# EAGLE schematic schematics (EAGLE 9.6.2)
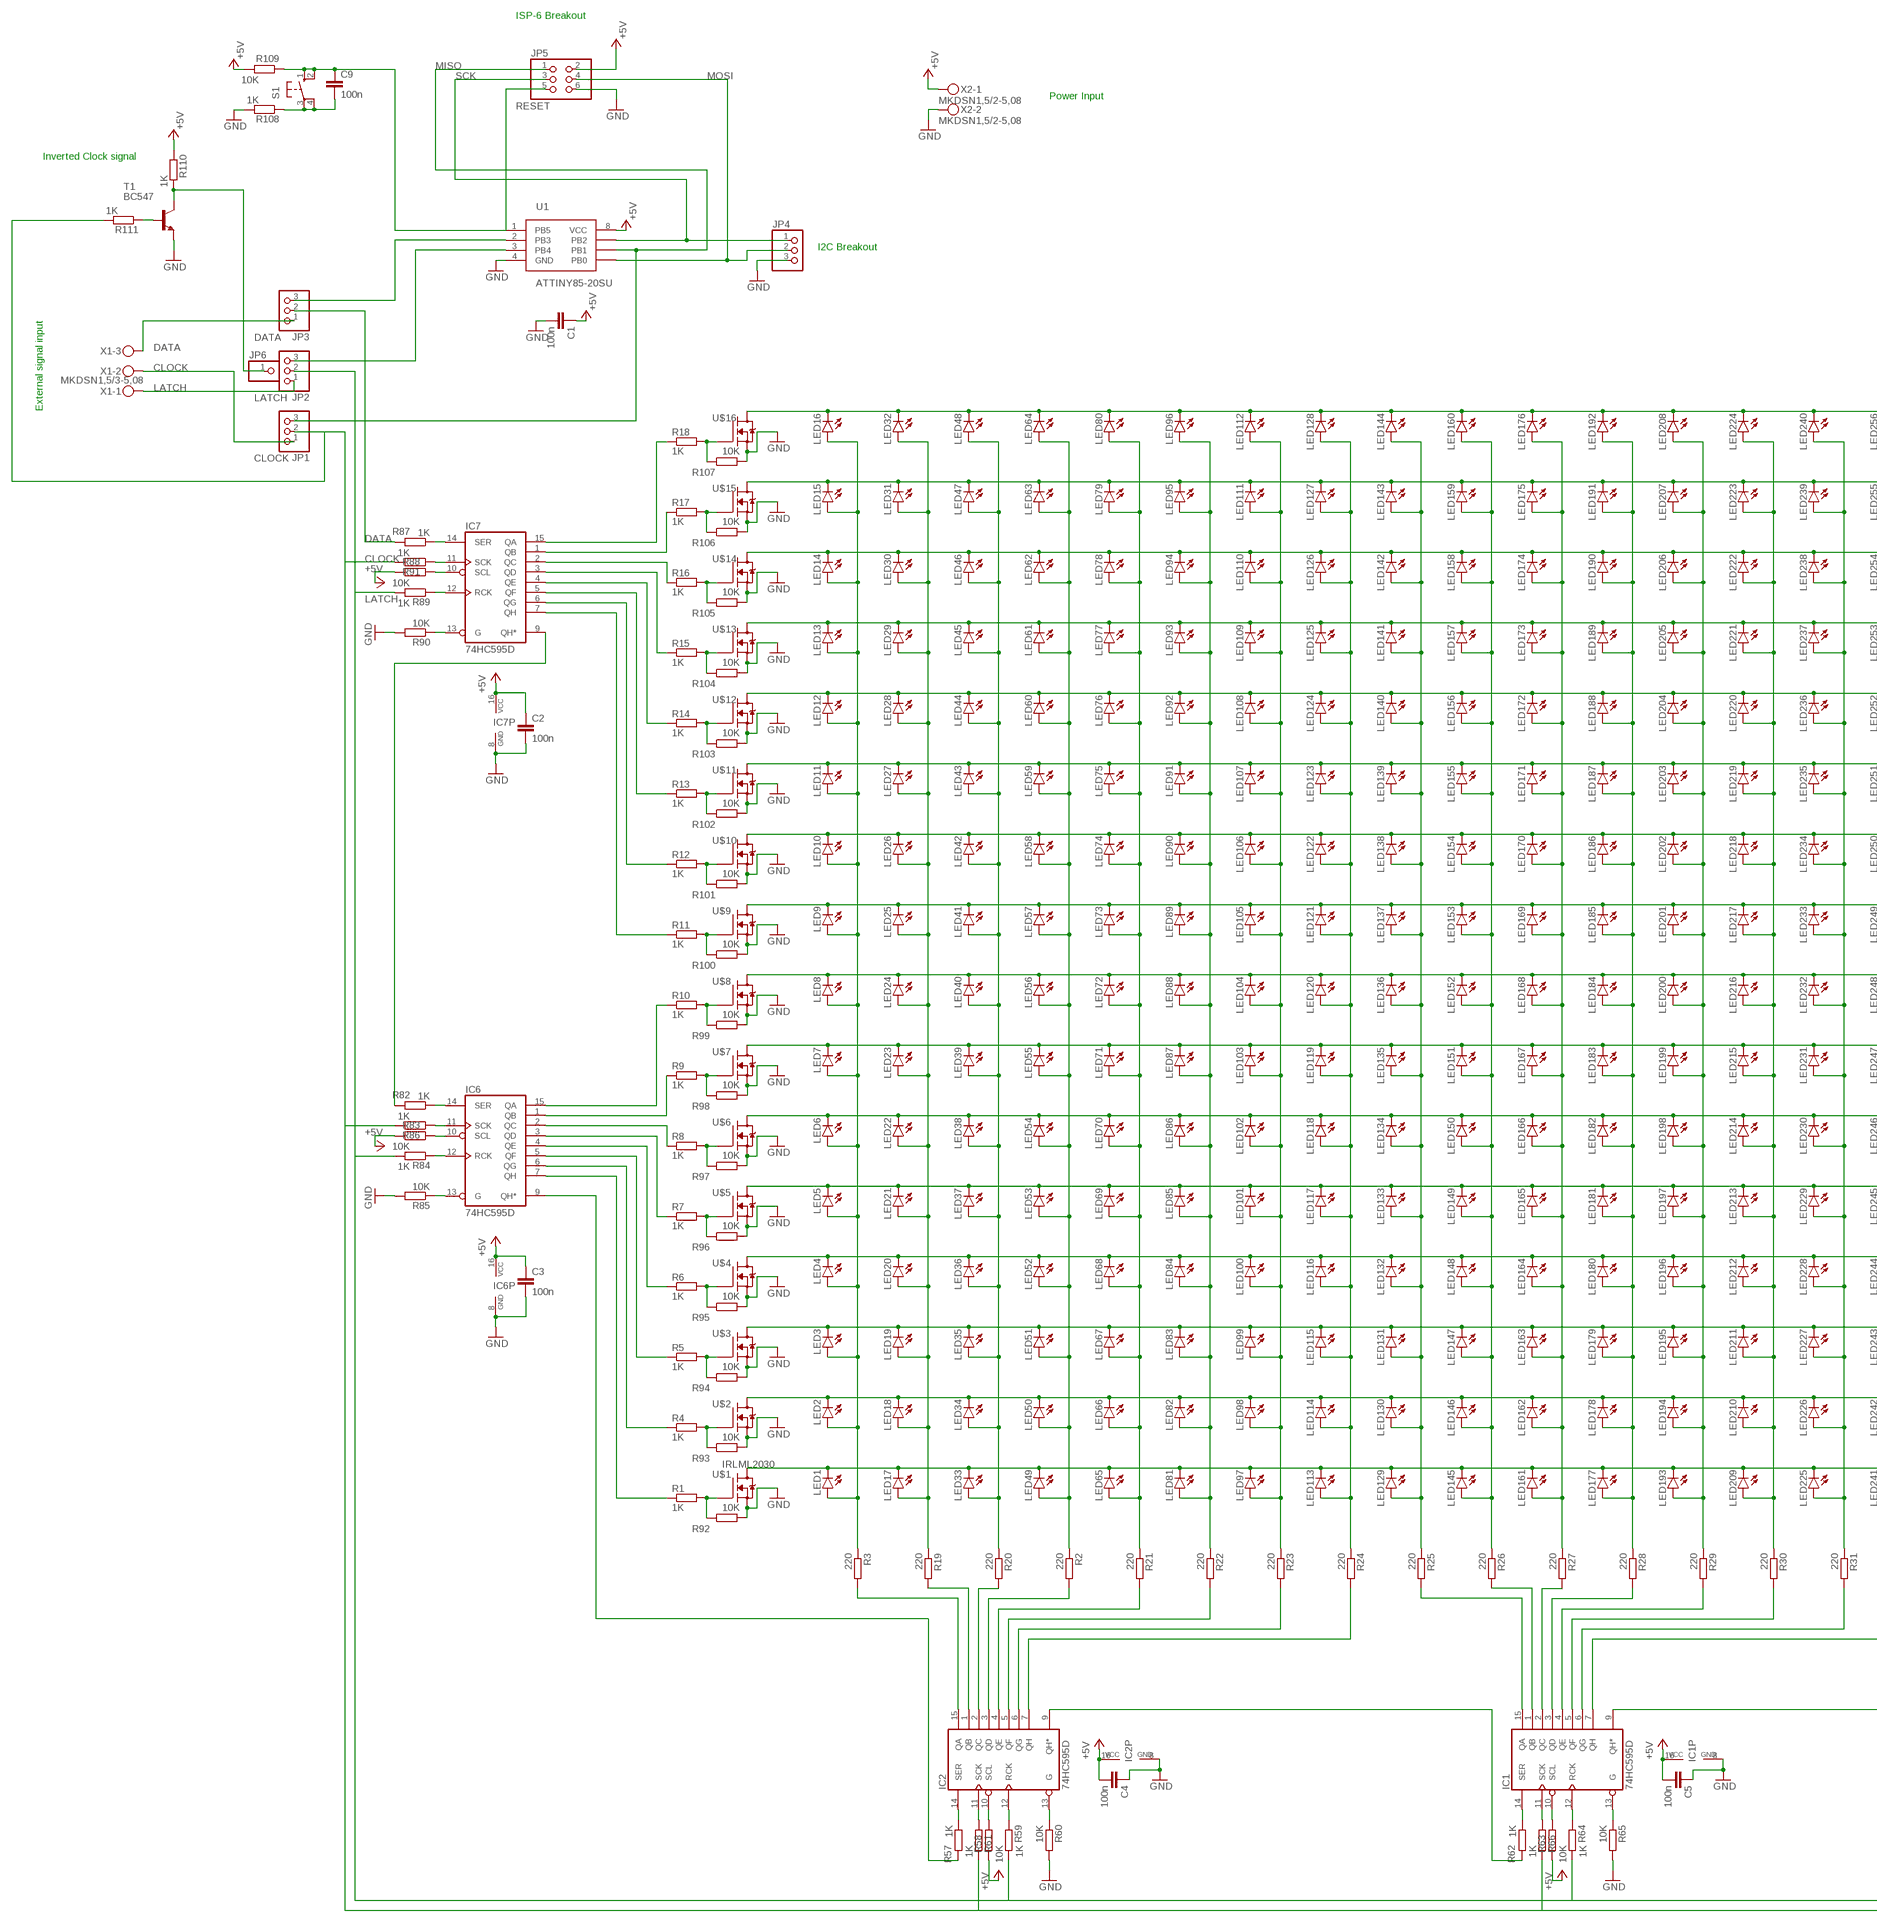
[diagram p0: schematic, sheet 1, part 1 of 2]
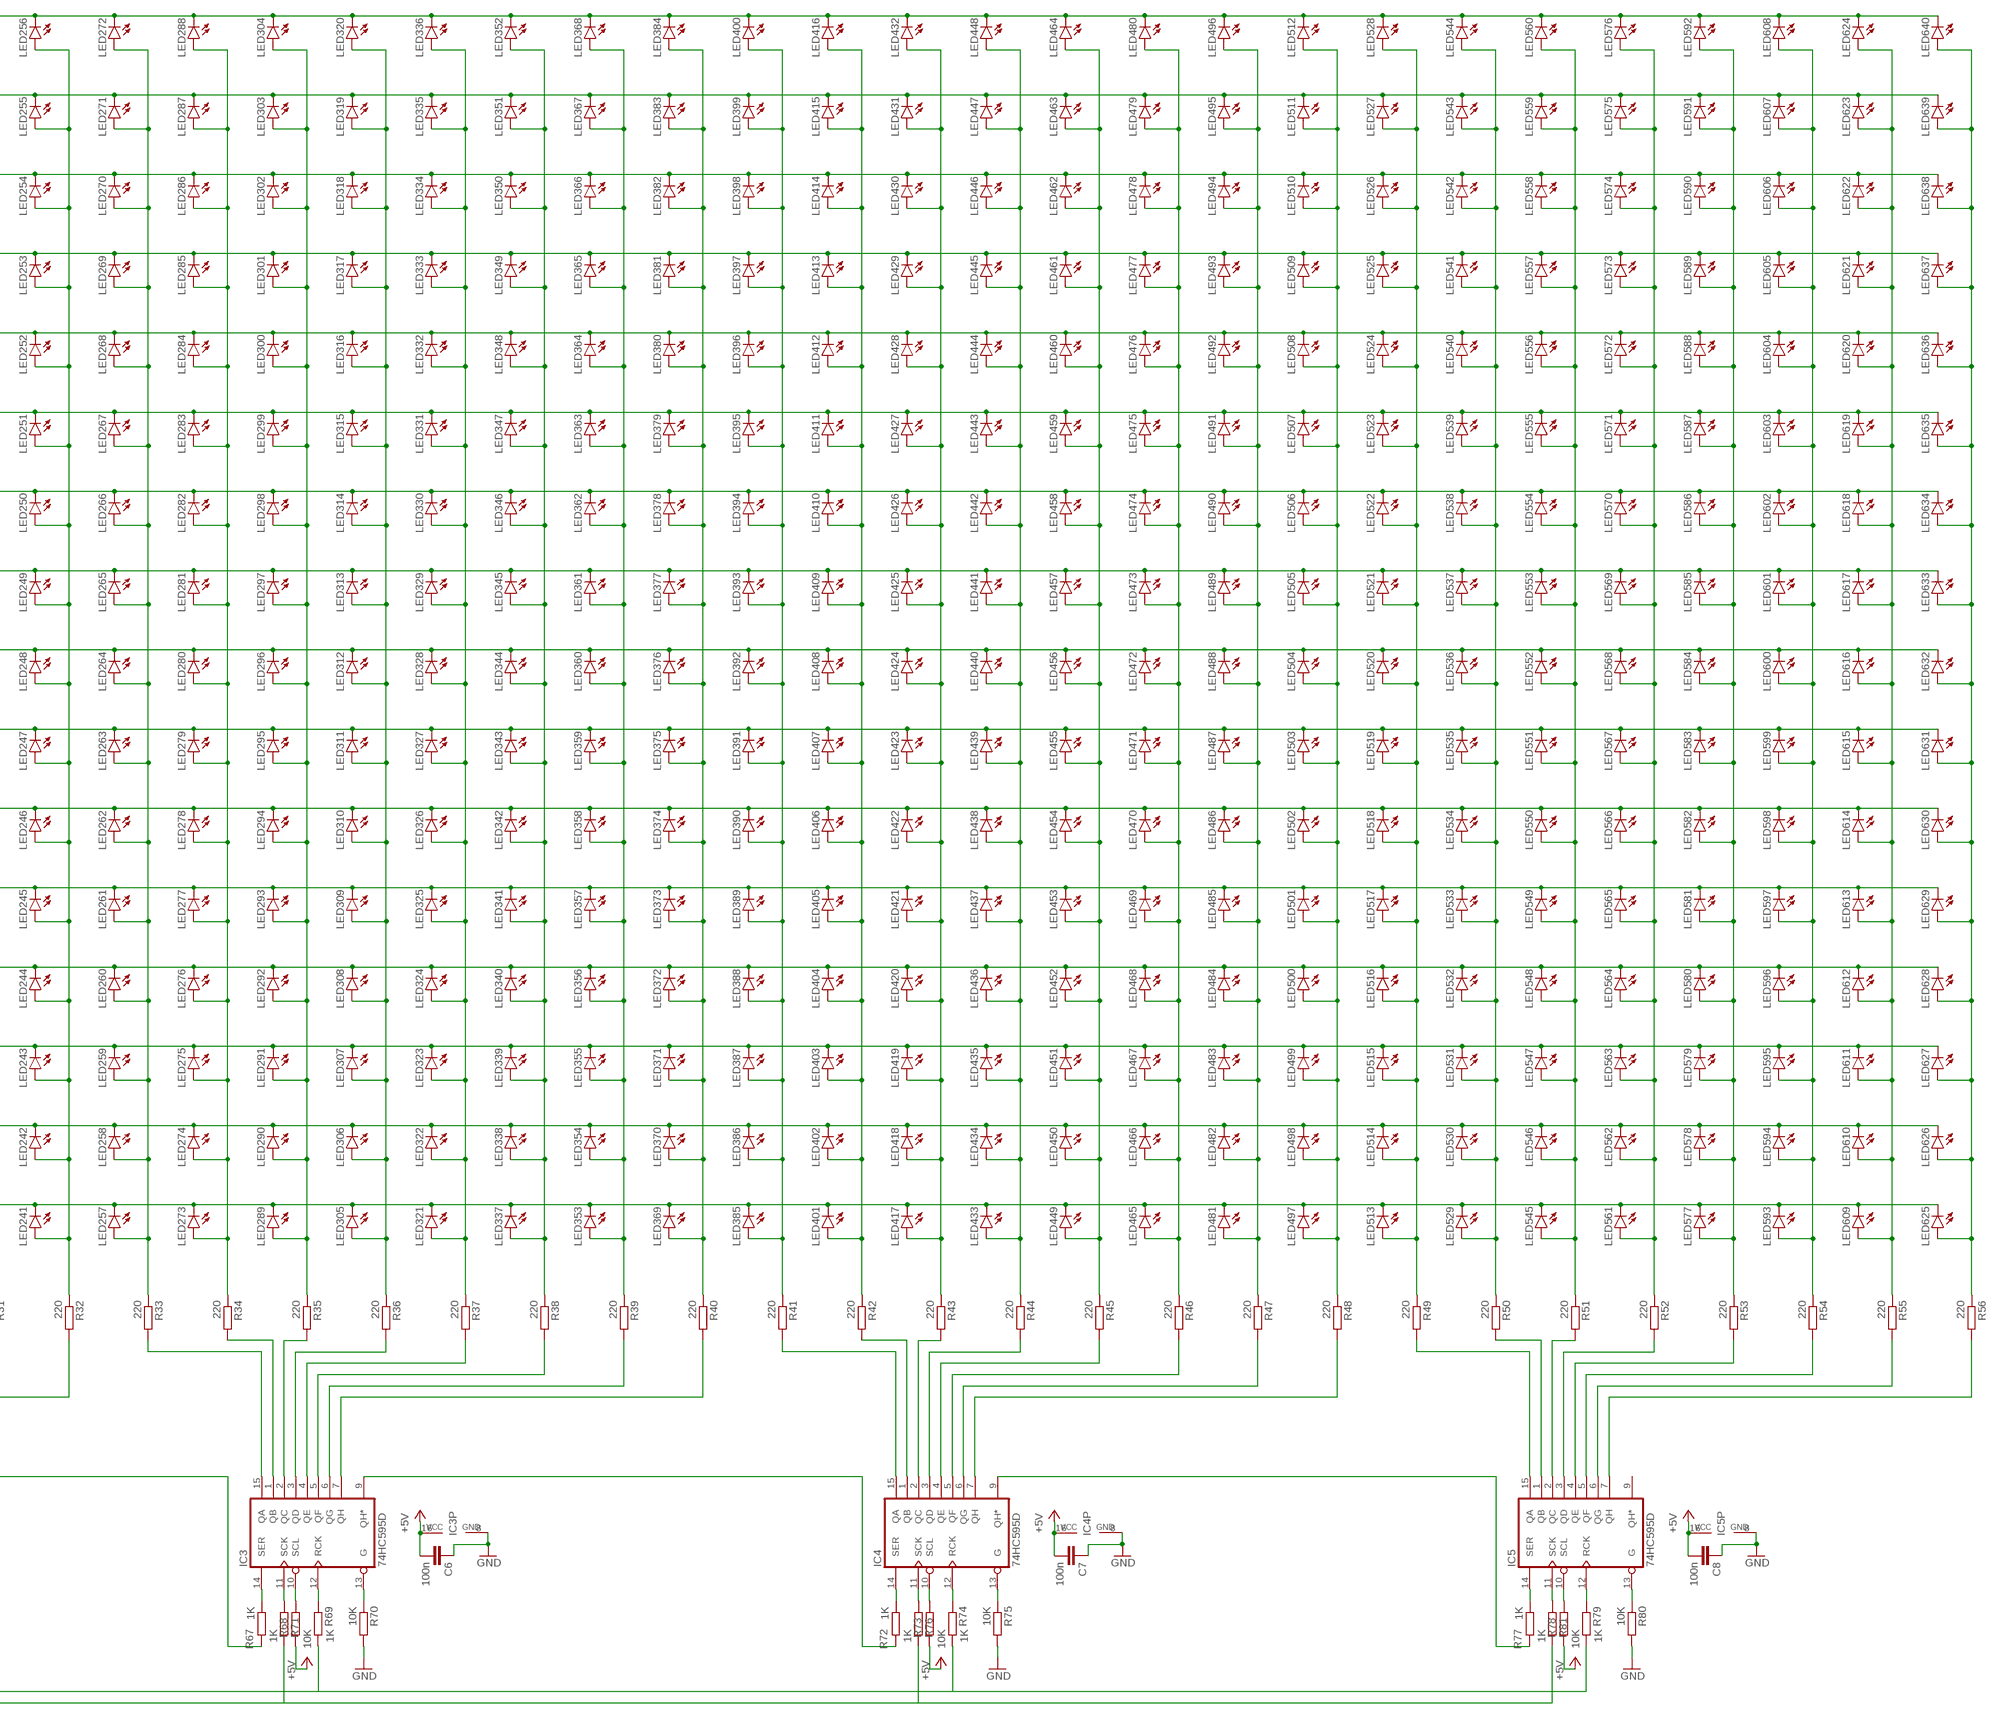
[diagram p1: schematic, sheet 1, part 2 of 2]

## Parts
C1  100n  C-EUC0805K  [C0805K]
C2  100n  C-EUC0805K  [C0805K]
C3  100n  C-EUC0805K  [C0805K]
C4  100n  C-EUC0805K  [C0805K]
C5  100n  C-EUC0805K  [C0805K]
C6  100n  C-EUC0805K  [C0805K]
C7  100n  C-EUC0805K  [C0805K]
C8  100n  C-EUC0805K  [C0805K]
C9  100n  C-EUC0805K  [C0805K]
IC1  74HC595D  [SO16]
IC2  74HC595D  [SO16]
IC3  74HC595D  [SO16]
IC4  74HC595D  [SO16]
IC5  74HC595D  [SO16]
IC6  74HC595D  [SO16]
IC7  74HC595D  [SO16]
JP1  PINHD-1X3  [1X03]
JP2  PINHD-1X3  [1X03]
JP3  PINHD-1X3  [1X03]
JP4  PINHD-1X3  [1X03]
JP5  PINHD-2X3  [2X03]
JP6  PINHD-1X1  [1X01]
LED1  LED3MM  [LED3MM]
LED2  LED3MM  [LED3MM]
LED3  LED3MM  [LED3MM]
LED4  LED3MM  [LED3MM]
LED5  LED3MM  [LED3MM]
LED6  LED3MM  [LED3MM]
LED7  LED3MM  [LED3MM]
LED8  LED3MM  [LED3MM]
LED9  LED3MM  [LED3MM]
LED10  LED3MM  [LED3MM]
LED11  LED3MM  [LED3MM]
LED12  LED3MM  [LED3MM]
LED13  LED3MM  [LED3MM]
LED14  LED3MM  [LED3MM]
LED15  LED3MM  [LED3MM]
LED16  LED3MM  [LED3MM]
LED17  LED3MM  [LED3MM]
LED18  LED3MM  [LED3MM]
LED19  LED3MM  [LED3MM]
LED20  LED3MM  [LED3MM]
LED21  LED3MM  [LED3MM]
LED22  LED3MM  [LED3MM]
LED23  LED3MM  [LED3MM]
LED24  LED3MM  [LED3MM]
LED25  LED3MM  [LED3MM]
LED26  LED3MM  [LED3MM]
LED27  LED3MM  [LED3MM]
LED28  LED3MM  [LED3MM]
LED29  LED3MM  [LED3MM]
LED30  LED3MM  [LED3MM]
LED31  LED3MM  [LED3MM]
LED32  LED3MM  [LED3MM]
LED33  LED3MM  [LED3MM]
LED34  LED3MM  [LED3MM]
LED35  LED3MM  [LED3MM]
LED36  LED3MM  [LED3MM]
LED37  LED3MM  [LED3MM]
LED38  LED3MM  [LED3MM]
LED39  LED3MM  [LED3MM]
LED40  LED3MM  [LED3MM]
LED41  LED3MM  [LED3MM]
LED42  LED3MM  [LED3MM]
LED43  LED3MM  [LED3MM]
LED44  LED3MM  [LED3MM]
LED45  LED3MM  [LED3MM]
LED46  LED3MM  [LED3MM]
LED47  LED3MM  [LED3MM]
LED48  LED3MM  [LED3MM]
LED49  LED3MM  [LED3MM]
LED50  LED3MM  [LED3MM]
LED51  LED3MM  [LED3MM]
LED52  LED3MM  [LED3MM]
LED53  LED3MM  [LED3MM]
LED54  LED3MM  [LED3MM]
LED55  LED3MM  [LED3MM]
LED56  LED3MM  [LED3MM]
LED57  LED3MM  [LED3MM]
LED58  LED3MM  [LED3MM]
LED59  LED3MM  [LED3MM]
LED60  LED3MM  [LED3MM]
LED61  LED3MM  [LED3MM]
LED62  LED3MM  [LED3MM]
LED63  LED3MM  [LED3MM]
LED64  LED3MM  [LED3MM]
LED65  LED3MM  [LED3MM]
LED66  LED3MM  [LED3MM]
LED67  LED3MM  [LED3MM]
LED68  LED3MM  [LED3MM]
LED69  LED3MM  [LED3MM]
LED70  LED3MM  [LED3MM]
LED71  LED3MM  [LED3MM]
LED72  LED3MM  [LED3MM]
LED73  LED3MM  [LED3MM]
LED74  LED3MM  [LED3MM]
LED75  LED3MM  [LED3MM]
LED76  LED3MM  [LED3MM]
LED77  LED3MM  [LED3MM]
LED78  LED3MM  [LED3MM]
LED79  LED3MM  [LED3MM]
LED80  LED3MM  [LED3MM]
LED81  LED3MM  [LED3MM]
LED82  LED3MM  [LED3MM]
LED83  LED3MM  [LED3MM]
LED84  LED3MM  [LED3MM]
LED85  LED3MM  [LED3MM]
LED86  LED3MM  [LED3MM]
LED87  LED3MM  [LED3MM]
LED88  LED3MM  [LED3MM]
LED89  LED3MM  [LED3MM]
LED90  LED3MM  [LED3MM]
LED91  LED3MM  [LED3MM]
LED92  LED3MM  [LED3MM]
LED93  LED3MM  [LED3MM]
LED94  LED3MM  [LED3MM]
LED95  LED3MM  [LED3MM]
LED96  LED3MM  [LED3MM]
LED97  LED3MM  [LED3MM]
LED98  LED3MM  [LED3MM]
LED99  LED3MM  [LED3MM]
LED100  LED3MM  [LED3MM]
LED101  LED3MM  [LED3MM]
LED102  LED3MM  [LED3MM]
LED103  LED3MM  [LED3MM]
LED104  LED3MM  [LED3MM]
LED105  LED3MM  [LED3MM]
LED106  LED3MM  [LED3MM]
LED107  LED3MM  [LED3MM]
LED108  LED3MM  [LED3MM]
LED109  LED3MM  [LED3MM]
LED110  LED3MM  [LED3MM]
LED111  LED3MM  [LED3MM]
LED112  LED3MM  [LED3MM]
LED113  LED3MM  [LED3MM]
LED114  LED3MM  [LED3MM]
LED115  LED3MM  [LED3MM]
LED116  LED3MM  [LED3MM]
LED117  LED3MM  [LED3MM]
LED118  LED3MM  [LED3MM]
LED119  LED3MM  [LED3MM]
LED120  LED3MM  [LED3MM]
LED121  LED3MM  [LED3MM]
LED122  LED3MM  [LED3MM]
LED123  LED3MM  [LED3MM]
LED124  LED3MM  [LED3MM]
LED125  LED3MM  [LED3MM]
LED126  LED3MM  [LED3MM]
LED127  LED3MM  [LED3MM]
LED128  LED3MM  [LED3MM]
LED129  LED3MM  [LED3MM]
LED130  LED3MM  [LED3MM]
LED131  LED3MM  [LED3MM]
LED132  LED3MM  [LED3MM]
LED133  LED3MM  [LED3MM]
LED134  LED3MM  [LED3MM]
LED135  LED3MM  [LED3MM]
LED136  LED3MM  [LED3MM]
LED137  LED3MM  [LED3MM]
LED138  LED3MM  [LED3MM]
LED139  LED3MM  [LED3MM]
LED140  LED3MM  [LED3MM]
LED141  LED3MM  [LED3MM]
LED142  LED3MM  [LED3MM]
LED143  LED3MM  [LED3MM]
LED144  LED3MM  [LED3MM]
LED145  LED3MM  [LED3MM]
LED146  LED3MM  [LED3MM]
LED147  LED3MM  [LED3MM]
LED148  LED3MM  [LED3MM]
LED149  LED3MM  [LED3MM]
LED150  LED3MM  [LED3MM]
LED151  LED3MM  [LED3MM]
LED152  LED3MM  [LED3MM]
LED153  LED3MM  [LED3MM]
LED154  LED3MM  [LED3MM]
LED155  LED3MM  [LED3MM]
LED156  LED3MM  [LED3MM]
LED157  LED3MM  [LED3MM]
LED158  LED3MM  [LED3MM]
LED159  LED3MM  [LED3MM]
LED160  LED3MM  [LED3MM]
LED161  LED3MM  [LED3MM]
LED162  LED3MM  [LED3MM]
LED163  LED3MM  [LED3MM]
LED164  LED3MM  [LED3MM]
LED165  LED3MM  [LED3MM]
LED166  LED3MM  [LED3MM]
LED167  LED3MM  [LED3MM]
LED168  LED3MM  [LED3MM]
LED169  LED3MM  [LED3MM]
LED170  LED3MM  [LED3MM]
LED171  LED3MM  [LED3MM]
LED172  LED3MM  [LED3MM]
LED173  LED3MM  [LED3MM]
LED174  LED3MM  [LED3MM]
LED175  LED3MM  [LED3MM]
LED176  LED3MM  [LED3MM]
LED177  LED3MM  [LED3MM]
LED178  LED3MM  [LED3MM]
LED179  LED3MM  [LED3MM]
LED180  LED3MM  [LED3MM]
LED181  LED3MM  [LED3MM]
LED182  LED3MM  [LED3MM]
LED183  LED3MM  [LED3MM]
LED184  LED3MM  [LED3MM]
LED185  LED3MM  [LED3MM]
LED186  LED3MM  [LED3MM]
LED187  LED3MM  [LED3MM]
LED188  LED3MM  [LED3MM]
LED189  LED3MM  [LED3MM]
LED190  LED3MM  [LED3MM]
LED191  LED3MM  [LED3MM]
LED192  LED3MM  [LED3MM]
LED193  LED3MM  [LED3MM]
LED194  LED3MM  [LED3MM]
LED195  LED3MM  [LED3MM]
LED196  LED3MM  [LED3MM]
LED197  LED3MM  [LED3MM]
LED198  LED3MM  [LED3MM]
LED199  LED3MM  [LED3MM]
LED200  LED3MM  [LED3MM]
LED201  LED3MM  [LED3MM]
LED202  LED3MM  [LED3MM]
LED203  LED3MM  [LED3MM]
LED204  LED3MM  [LED3MM]
LED205  LED3MM  [LED3MM]
LED206  LED3MM  [LED3MM]
LED207  LED3MM  [LED3MM]
LED208  LED3MM  [LED3MM]
LED209  LED3MM  [LED3MM]
LED210  LED3MM  [LED3MM]
LED211  LED3MM  [LED3MM]
LED212  LED3MM  [LED3MM]
LED213  LED3MM  [LED3MM]
LED214  LED3MM  [LED3MM]
LED215  LED3MM  [LED3MM]
LED216  LED3MM  [LED3MM]
LED217  LED3MM  [LED3MM]
LED218  LED3MM  [LED3MM]
LED219  LED3MM  [LED3MM]
LED220  LED3MM  [LED3MM]
LED221  LED3MM  [LED3MM]
LED222  LED3MM  [LED3MM]
LED223  LED3MM  [LED3MM]
LED224  LED3MM  [LED3MM]
LED225  LED3MM  [LED3MM]
LED226  LED3MM  [LED3MM]
LED227  LED3MM  [LED3MM]
LED228  LED3MM  [LED3MM]
LED229  LED3MM  [LED3MM]
LED230  LED3MM  [LED3MM]
LED231  LED3MM  [LED3MM]
LED232  LED3MM  [LED3MM]
LED233  LED3MM  [LED3MM]
LED234  LED3MM  [LED3MM]
LED235  LED3MM  [LED3MM]
LED236  LED3MM  [LED3MM]
LED237  LED3MM  [LED3MM]
LED238  LED3MM  [LED3MM]
LED239  LED3MM  [LED3MM]
LED240  LED3MM  [LED3MM]
LED241  LED3MM  [LED3MM]
LED242  LED3MM  [LED3MM]
LED243  LED3MM  [LED3MM]
LED244  LED3MM  [LED3MM]
LED245  LED3MM  [LED3MM]
LED246  LED3MM  [LED3MM]
LED247  LED3MM  [LED3MM]
LED248  LED3MM  [LED3MM]
LED249  LED3MM  [LED3MM]
LED250  LED3MM  [LED3MM]
LED251  LED3MM  [LED3MM]
LED252  LED3MM  [LED3MM]
LED253  LED3MM  [LED3MM]
LED254  LED3MM  [LED3MM]
LED255  LED3MM  [LED3MM]
LED256  LED3MM  [LED3MM]
LED257  LED3MM  [LED3MM]
LED258  LED3MM  [LED3MM]
LED259  LED3MM  [LED3MM]
LED260  LED3MM  [LED3MM]
LED261  LED3MM  [LED3MM]
LED262  LED3MM  [LED3MM]
LED263  LED3MM  [LED3MM]
LED264  LED3MM  [LED3MM]
LED265  LED3MM  [LED3MM]
LED266  LED3MM  [LED3MM]
LED267  LED3MM  [LED3MM]
LED268  LED3MM  [LED3MM]
LED269  LED3MM  [LED3MM]
LED270  LED3MM  [LED3MM]
LED271  LED3MM  [LED3MM]
LED272  LED3MM  [LED3MM]
LED273  LED3MM  [LED3MM]
LED274  LED3MM  [LED3MM]
LED275  LED3MM  [LED3MM]
LED276  LED3MM  [LED3MM]
LED277  LED3MM  [LED3MM]
LED278  LED3MM  [LED3MM]
LED279  LED3MM  [LED3MM]
LED280  LED3MM  [LED3MM]
LED281  LED3MM  [LED3MM]
LED282  LED3MM  [LED3MM]
LED283  LED3MM  [LED3MM]
LED284  LED3MM  [LED3MM]
LED285  LED3MM  [LED3MM]
LED286  LED3MM  [LED3MM]
LED287  LED3MM  [LED3MM]
LED288  LED3MM  [LED3MM]
LED289  LED3MM  [LED3MM]
LED290  LED3MM  [LED3MM]
LED291  LED3MM  [LED3MM]
LED292  LED3MM  [LED3MM]
LED293  LED3MM  [LED3MM]
LED294  LED3MM  [LED3MM]
LED295  LED3MM  [LED3MM]
LED296  LED3MM  [LED3MM]
LED297  LED3MM  [LED3MM]
LED298  LED3MM  [LED3MM]
LED299  LED3MM  [LED3MM]
LED300  LED3MM  [LED3MM]
LED301  LED3MM  [LED3MM]
LED302  LED3MM  [LED3MM]
LED303  LED3MM  [LED3MM]
LED304  LED3MM  [LED3MM]
LED305  LED3MM  [LED3MM]
LED306  LED3MM  [LED3MM]
LED307  LED3MM  [LED3MM]
LED308  LED3MM  [LED3MM]
LED309  LED3MM  [LED3MM]
LED310  LED3MM  [LED3MM]
LED311  LED3MM  [LED3MM]
LED312  LED3MM  [LED3MM]
LED313  LED3MM  [LED3MM]
LED314  LED3MM  [LED3MM]
LED315  LED3MM  [LED3MM]
LED316  LED3MM  [LED3MM]
LED317  LED3MM  [LED3MM]
LED318  LED3MM  [LED3MM]
LED319  LED3MM  [LED3MM]
LED320  LED3MM  [LED3MM]
LED321  LED3MM  [LED3MM]
LED322  LED3MM  [LED3MM]
LED323  LED3MM  [LED3MM]
LED324  LED3MM  [LED3MM]
LED325  LED3MM  [LED3MM]
LED326  LED3MM  [LED3MM]
LED327  LED3MM  [LED3MM]
LED328  LED3MM  [LED3MM]
LED329  LED3MM  [LED3MM]
LED330  LED3MM  [LED3MM]
LED331  LED3MM  [LED3MM]
LED332  LED3MM  [LED3MM]
LED333  LED3MM  [LED3MM]
LED334  LED3MM  [LED3MM]
LED335  LED3MM  [LED3MM]
LED336  LED3MM  [LED3MM]
LED337  LED3MM  [LED3MM]
LED338  LED3MM  [LED3MM]
LED339  LED3MM  [LED3MM]
LED340  LED3MM  [LED3MM]
LED341  LED3MM  [LED3MM]
LED342  LED3MM  [LED3MM]
LED343  LED3MM  [LED3MM]
LED344  LED3MM  [LED3MM]
LED345  LED3MM  [LED3MM]
LED346  LED3MM  [LED3MM]
LED347  LED3MM  [LED3MM]
LED348  LED3MM  [LED3MM]
LED349  LED3MM  [LED3MM]
LED350  LED3MM  [LED3MM]
LED351  LED3MM  [LED3MM]
LED352  LED3MM  [LED3MM]
LED353  LED3MM  [LED3MM]
LED354  LED3MM  [LED3MM]
LED355  LED3MM  [LED3MM]
LED356  LED3MM  [LED3MM]
LED357  LED3MM  [LED3MM]
LED358  LED3MM  [LED3MM]
LED359  LED3MM  [LED3MM]
LED360  LED3MM  [LED3MM]
LED361  LED3MM  [LED3MM]
LED362  LED3MM  [LED3MM]
LED363  LED3MM  [LED3MM]
LED364  LED3MM  [LED3MM]
LED365  LED3MM  [LED3MM]
LED366  LED3MM  [LED3MM]
LED367  LED3MM  [LED3MM]
LED368  LED3MM  [LED3MM]
LED369  LED3MM  [LED3MM]
LED370  LED3MM  [LED3MM]
LED371  LED3MM  [LED3MM]
LED372  LED3MM  [LED3MM]
LED373  LED3MM  [LED3MM]
LED374  LED3MM  [LED3MM]
LED375  LED3MM  [LED3MM]
LED376  LED3MM  [LED3MM]
LED377  LED3MM  [LED3MM]
LED378  LED3MM  [LED3MM]
LED379  LED3MM  [LED3MM]
LED380  LED3MM  [LED3MM]
LED381  LED3MM  [LED3MM]
LED382  LED3MM  [LED3MM]
LED383  LED3MM  [LED3MM]
LED384  LED3MM  [LED3MM]
LED385  LED3MM  [LED3MM]
LED386  LED3MM  [LED3MM]
LED387  LED3MM  [LED3MM]
LED388  LED3MM  [LED3MM]
LED389  LED3MM  [LED3MM]
LED390  LED3MM  [LED3MM]
LED391  LED3MM  [LED3MM]
LED392  LED3MM  [LED3MM]
LED393  LED3MM  [LED3MM]
LED394  LED3MM  [LED3MM]
LED395  LED3MM  [LED3MM]
LED396  LED3MM  [LED3MM]
LED397  LED3MM  [LED3MM]
LED398  LED3MM  [LED3MM]
LED399  LED3MM  [LED3MM]
LED400  LED3MM  [LED3MM]
LED401  LED3MM  [LED3MM]
LED402  LED3MM  [LED3MM]
LED403  LED3MM  [LED3MM]
LED404  LED3MM  [LED3MM]
LED405  LED3MM  [LED3MM]
LED406  LED3MM  [LED3MM]
LED407  LED3MM  [LED3MM]
LED408  LED3MM  [LED3MM]
LED409  LED3MM  [LED3MM]
LED410  LED3MM  [LED3MM]
LED411  LED3MM  [LED3MM]
LED412  LED3MM  [LED3MM]
LED413  LED3MM  [LED3MM]
LED414  LED3MM  [LED3MM]
LED415  LED3MM  [LED3MM]
LED416  LED3MM  [LED3MM]
LED417  LED3MM  [LED3MM]
LED418  LED3MM  [LED3MM]
LED419  LED3MM  [LED3MM]
LED420  LED3MM  [LED3MM]
LED421  LED3MM  [LED3MM]
LED422  LED3MM  [LED3MM]
LED423  LED3MM  [LED3MM]
LED424  LED3MM  [LED3MM]
LED425  LED3MM  [LED3MM]
LED426  LED3MM  [LED3MM]
LED427  LED3MM  [LED3MM]
LED428  LED3MM  [LED3MM]
LED429  LED3MM  [LED3MM]
LED430  LED3MM  [LED3MM]
LED431  LED3MM  [LED3MM]
LED432  LED3MM  [LED3MM]
LED433  LED3MM  [LED3MM]
LED434  LED3MM  [LED3MM]
LED435  LED3MM  [LED3MM]
LED436  LED3MM  [LED3MM]
LED437  LED3MM  [LED3MM]
LED438  LED3MM  [LED3MM]
LED439  LED3MM  [LED3MM]
LED440  LED3MM  [LED3MM]
LED441  LED3MM  [LED3MM]
LED442  LED3MM  [LED3MM]
LED443  LED3MM  [LED3MM]
LED444  LED3MM  [LED3MM]
LED445  LED3MM  [LED3MM]
LED446  LED3MM  [LED3MM]
LED447  LED3MM  [LED3MM]
LED448  LED3MM  [LED3MM]
LED449  LED3MM  [LED3MM]
LED450  LED3MM  [LED3MM]
LED451  LED3MM  [LED3MM]
LED452  LED3MM  [LED3MM]
LED453  LED3MM  [LED3MM]
LED454  LED3MM  [LED3MM]
LED455  LED3MM  [LED3MM]
LED456  LED3MM  [LED3MM]
LED457  LED3MM  [LED3MM]
LED458  LED3MM  [LED3MM]
LED459  LED3MM  [LED3MM]
LED460  LED3MM  [LED3MM]
LED461  LED3MM  [LED3MM]
LED462  LED3MM  [LED3MM]
LED463  LED3MM  [LED3MM]
LED464  LED3MM  [LED3MM]
LED465  LED3MM  [LED3MM]
LED466  LED3MM  [LED3MM]
LED467  LED3MM  [LED3MM]
LED468  LED3MM  [LED3MM]
LED469  LED3MM  [LED3MM]
LED470  LED3MM  [LED3MM]
LED471  LED3MM  [LED3MM]
LED472  LED3MM  [LED3MM]
LED473  LED3MM  [LED3MM]
LED474  LED3MM  [LED3MM]
LED475  LED3MM  [LED3MM]
LED476  LED3MM  [LED3MM]
LED477  LED3MM  [LED3MM]
LED478  LED3MM  [LED3MM]
LED479  LED3MM  [LED3MM]
LED480  LED3MM  [LED3MM]
LED481  LED3MM  [LED3MM]
LED482  LED3MM  [LED3MM]
LED483  LED3MM  [LED3MM]
LED484  LED3MM  [LED3MM]
LED485  LED3MM  [LED3MM]
LED486  LED3MM  [LED3MM]
LED487  LED3MM  [LED3MM]
LED488  LED3MM  [LED3MM]
LED489  LED3MM  [LED3MM]
LED490  LED3MM  [LED3MM]
LED491  LED3MM  [LED3MM]
LED492  LED3MM  [LED3MM]
LED493  LED3MM  [LED3MM]
LED494  LED3MM  [LED3MM]
LED495  LED3MM  [LED3MM]
LED496  LED3MM  [LED3MM]
LED497  LED3MM  [LED3MM]
LED498  LED3MM  [LED3MM]
LED499  LED3MM  [LED3MM]
LED500  LED3MM  [LED3MM]
LED501  LED3MM  [LED3MM]
LED502  LED3MM  [LED3MM]
LED503  LED3MM  [LED3MM]
LED504  LED3MM  [LED3MM]
LED505  LED3MM  [LED3MM]
LED506  LED3MM  [LED3MM]
LED507  LED3MM  [LED3MM]
LED508  LED3MM  [LED3MM]
LED509  LED3MM  [LED3MM]
LED510  LED3MM  [LED3MM]
LED511  LED3MM  [LED3MM]
LED512  LED3MM  [LED3MM]
LED513  LED3MM  [LED3MM]
LED514  LED3MM  [LED3MM]
LED515  LED3MM  [LED3MM]
LED516  LED3MM  [LED3MM]
LED517  LED3MM  [LED3MM]
LED518  LED3MM  [LED3MM]
LED519  LED3MM  [LED3MM]
LED520  LED3MM  [LED3MM]
LED521  LED3MM  [LED3MM]
LED522  LED3MM  [LED3MM]
LED523  LED3MM  [LED3MM]
LED524  LED3MM  [LED3MM]
LED525  LED3MM  [LED3MM]
LED526  LED3MM  [LED3MM]
LED527  LED3MM  [LED3MM]
LED528  LED3MM  [LED3MM]
LED529  LED3MM  [LED3MM]
LED530  LED3MM  [LED3MM]
LED531  LED3MM  [LED3MM]
LED532  LED3MM  [LED3MM]
LED533  LED3MM  [LED3MM]
LED534  LED3MM  [LED3MM]
LED535  LED3MM  [LED3MM]
LED536  LED3MM  [LED3MM]
LED537  LED3MM  [LED3MM]
LED538  LED3MM  [LED3MM]
LED539  LED3MM  [LED3MM]
LED540  LED3MM  [LED3MM]
LED541  LED3MM  [LED3MM]
LED542  LED3MM  [LED3MM]
LED543  LED3MM  [LED3MM]
LED544  LED3MM  [LED3MM]
LED545  LED3MM  [LED3MM]
LED546  LED3MM  [LED3MM]
LED547  LED3MM  [LED3MM]
LED548  LED3MM  [LED3MM]
LED549  LED3MM  [LED3MM]
LED550  LED3MM  [LED3MM]
LED551  LED3MM  [LED3MM]
LED552  LED3MM  [LED3MM]
LED553  LED3MM  [LED3MM]
LED554  LED3MM  [LED3MM]
LED555  LED3MM  [LED3MM]
LED556  LED3MM  [LED3MM]
LED557  LED3MM  [LED3MM]
LED558  LED3MM  [LED3MM]
LED559  LED3MM  [LED3MM]
LED560  LED3MM  [LED3MM]
LED561  LED3MM  [LED3MM]
LED562  LED3MM  [LED3MM]
LED563  LED3MM  [LED3MM]
LED564  LED3MM  [LED3MM]
LED565  LED3MM  [LED3MM]
LED566  LED3MM  [LED3MM]
LED567  LED3MM  [LED3MM]
LED568  LED3MM  [LED3MM]
LED569  LED3MM  [LED3MM]
LED570  LED3MM  [LED3MM]
LED571  LED3MM  [LED3MM]
LED572  LED3MM  [LED3MM]
LED573  LED3MM  [LED3MM]
LED574  LED3MM  [LED3MM]
LED575  LED3MM  [LED3MM]
LED576  LED3MM  [LED3MM]
LED577  LED3MM  [LED3MM]
LED578  LED3MM  [LED3MM]
LED579  LED3MM  [LED3MM]
LED580  LED3MM  [LED3MM]
LED581  LED3MM  [LED3MM]
LED582  LED3MM  [LED3MM]
LED583  LED3MM  [LED3MM]
LED584  LED3MM  [LED3MM]
LED585  LED3MM  [LED3MM]
LED586  LED3MM  [LED3MM]
LED587  LED3MM  [LED3MM]
LED588  LED3MM  [LED3MM]
LED589  LED3MM  [LED3MM]
LED590  LED3MM  [LED3MM]
LED591  LED3MM  [LED3MM]
LED592  LED3MM  [LED3MM]
LED593  LED3MM  [LED3MM]
LED594  LED3MM  [LED3MM]
LED595  LED3MM  [LED3MM]
LED596  LED3MM  [LED3MM]
LED597  LED3MM  [LED3MM]
LED598  LED3MM  [LED3MM]
LED599  LED3MM  [LED3MM]
LED600  LED3MM  [LED3MM]
LED601  LED3MM  [LED3MM]
LED602  LED3MM  [LED3MM]
LED603  LED3MM  [LED3MM]
LED604  LED3MM  [LED3MM]
LED605  LED3MM  [LED3MM]
LED606  LED3MM  [LED3MM]
LED607  LED3MM  [LED3MM]
LED608  LED3MM  [LED3MM]
LED609  LED3MM  [LED3MM]
LED610  LED3MM  [LED3MM]
LED611  LED3MM  [LED3MM]
LED612  LED3MM  [LED3MM]
LED613  LED3MM  [LED3MM]
LED614  LED3MM  [LED3MM]
LED615  LED3MM  [LED3MM]
LED616  LED3MM  [LED3MM]
LED617  LED3MM  [LED3MM]
LED618  LED3MM  [LED3MM]
LED619  LED3MM  [LED3MM]
LED620  LED3MM  [LED3MM]
LED621  LED3MM  [LED3MM]
LED622  LED3MM  [LED3MM]
LED623  LED3MM  [LED3MM]
LED624  LED3MM  [LED3MM]
LED625  LED3MM  [LED3MM]
LED626  LED3MM  [LED3MM]
LED627  LED3MM  [LED3MM]
LED628  LED3MM  [LED3MM]
LED629  LED3MM  [LED3MM]
LED630  LED3MM  [LED3MM]
LED631  LED3MM  [LED3MM]
LED632  LED3MM  [LED3MM]
LED633  LED3MM  [LED3MM]
LED634  LED3MM  [LED3MM]
LED635  LED3MM  [LED3MM]
LED636  LED3MM  [LED3MM]
LED637  LED3MM  [LED3MM]
LED638  LED3MM  [LED3MM]
LED639  LED3MM  [LED3MM]
LED640  LED3MM  [LED3MM]
R1  1K  R-EU_R0805W  [R0805W]
R2  220  R-EU_R0805W  [R0805W]
R3  220  R-EU_R0805W  [R0805W]
R4  1K  R-EU_R0805W  [R0805W]
R5  1K  R-EU_R0805W  [R0805W]
R6  1K  R-EU_R0805W  [R0805W]
R7  1K  R-EU_R0805W  [R0805W]
R8  1K  R-EU_R0805W  [R0805W]
R9  1K  R-EU_R0805W  [R0805W]
R10  1K  R-EU_R0805W  [R0805W]
R11  1K  R-EU_R0805W  [R0805W]
R12  1K  R-EU_R0805W  [R0805W]
R13  1K  R-EU_R0805W  [R0805W]
R14  1K  R-EU_R0805W  [R0805W]
R15  1K  R-EU_R0805W  [R0805W]
R16  1K  R-EU_R0805W  [R0805W]
R17  1K  R-EU_R0805W  [R0805W]
R18  1K  R-EU_R0805W  [R0805W]
R19  220  R-EU_R0805W  [R0805W]
R20  220  R-EU_R0805W  [R0805W]
R21  220  R-EU_R0805W  [R0805W]
R22  220  R-EU_R0805W  [R0805W]
R23  220  R-EU_R0805W  [R0805W]
R24  220  R-EU_R0805W  [R0805W]
R25  220  R-EU_R0805W  [R0805W]
R26  220  R-EU_R0805W  [R0805W]
R27  220  R-EU_R0805W  [R0805W]
R28  220  R-EU_R0805W  [R0805W]
R29  220  R-EU_R0805W  [R0805W]
R30  220  R-EU_R0805W  [R0805W]
R31  220  R-EU_R0805W  [R0805W]
R32  220  R-EU_R0805W  [R0805W]
R33  220  R-EU_R0805W  [R0805W]
R34  220  R-EU_R0805W  [R0805W]
R35  220  R-EU_R0805W  [R0805W]
R36  220  R-EU_R0805W  [R0805W]
R37  220  R-EU_R0805W  [R0805W]
R38  220  R-EU_R0805W  [R0805W]
R39  220  R-EU_R0805W  [R0805W]
R40  220  R-EU_R0805W  [R0805W]
R41  220  R-EU_R0805W  [R0805W]
R42  220  R-EU_R0805W  [R0805W]
R43  220  R-EU_R0805W  [R0805W]
R44  220  R-EU_R0805W  [R0805W]
R45  220  R-EU_R0805W  [R0805W]
R46  220  R-EU_R0805W  [R0805W]
R47  220  R-EU_R0805W  [R0805W]
R48  220  R-EU_R0805W  [R0805W]
R49  220  R-EU_R0805W  [R0805W]
R50  220  R-EU_R0805W  [R0805W]
R51  220  R-EU_R0805W  [R0805W]
R52  220  R-EU_R0805W  [R0805W]
R53  220  R-EU_R0805W  [R0805W]
R54  220  R-EU_R0805W  [R0805W]
R55  220  R-EU_R0805W  [R0805W]
R56  220  R-EU_R0805W  [R0805W]
R57  1K  R-EU_R0805W  [R0805W]
R58  1K  R-EU_R0805W  [R0805W]
R59  1K  R-EU_R0805W  [R0805W]
R60  10K  R-EU_R0805W  [R0805W]
R61  10K  R-EU_R0805W  [R0805W]
R62  1K  R-EU_R0805W  [R0805W]
R63  1K  R-EU_R0805W  [R0805W]
R64  1K  R-EU_R0805W  [R0805W]
R65  10K  R-EU_R0805W  [R0805W]
R66  10K  R-EU_R0805W  [R0805W]
R67  1K  R-EU_R0805W  [R0805W]
R68  1K  R-EU_R0805W  [R0805W]
R69  1K  R-EU_R0805W  [R0805W]
R70  10K  R-EU_R0805W  [R0805W]
R71  10K  R-EU_R0805W  [R0805W]
R72  1K  R-EU_R0805W  [R0805W]
R73  1K  R-EU_R0805W  [R0805W]
R74  1K  R-EU_R0805W  [R0805W]
R75  10K  R-EU_R0805W  [R0805W]
R76  10K  R-EU_R0805W  [R0805W]
R77  1K  R-EU_R0805W  [R0805W]
R78  1K  R-EU_R0805W  [R0805W]
R79  1K  R-EU_R0805W  [R0805W]
R80  10K  R-EU_R0805W  [R0805W]
R81  10K  R-EU_R0805W  [R0805W]
R82  1K  R-EU_R0805W  [R0805W]
R83  1K  R-EU_R0805W  [R0805W]
R84  1K  R-EU_R0805W  [R0805W]
R85  10K  R-EU_R0805W  [R0805W]
R86  10K  R-EU_R0805W  [R0805W]
R87  1K  R-EU_R0805W  [R0805W]
R88  1K  R-EU_R0805W  [R0805W]
R89  1K  R-EU_R0805W  [R0805W]
R90  10K  R-EU_R0805W  [R0805W]
R91  10K  R-EU_R0805W  [R0805W]
R92  10K  R-EU_R0805W  [R0805W]
R93  10K  R-EU_R0805W  [R0805W]
R94  10K  R-EU_R0805W  [R0805W]
R95  10K  R-EU_R0805W  [R0805W]
R96  10K  R-EU_R0805W  [R0805W]
R97  10K  R-EU_R0805W  [R0805W]
R98  10K  R-EU_R0805W  [R0805W]
R99  10K  R-EU_R0805W  [R0805W]
R100  10K  R-EU_R0805W  [R0805W]
R101  10K  R-EU_R0805W  [R0805W]
R102  10K  R-EU_R0805W  [R0805W]
R103  10K  R-EU_R0805W  [R0805W]
R104  10K  R-EU_R0805W  [R0805W]
R105  10K  R-EU_R0805W  [R0805W]
R106  10K  R-EU_R0805W  [R0805W]
R107  10K  R-EU_R0805W  [R0805W]
R108  1K  R-EU_R0805W  [R0805W]
R109  10K  R-EU_R0805W  [R0805W]
R110  1K  R-EU_R0805W  [R0805W]
R111  1K  R-EU_R0805W  [R0805W]
S1  10-XX  [B3F-10XX]
T1  BC547  [TO92]
U1  ATTINY85-20SU  [SOIC-8]
U$1  IRLML2030  [SOT23]
U$2  IRLML2030  [SOT23]
U$3  IRLML2030  [SOT23]
U$4  IRLML2030  [SOT23]
U$5  IRLML2030  [SOT23]
U$6  IRLML2030  [SOT23]
U$7  IRLML2030  [SOT23]
U$8  IRLML2030  [SOT23]
U$9  IRLML2030  [SOT23]
U$10  IRLML2030  [SOT23]
U$11  IRLML2030  [SOT23]
U$12  IRLML2030  [SOT23]
U$13  IRLML2030  [SOT23]
U$14  IRLML2030  [SOT23]
U$15  IRLML2030  [SOT23]
U$16  IRLML2030  [SOT23]
X1  MKDSN1,5/3-5,08  [MKDSN1,5/3-5,08]
X2  MKDSN1,5/2-5,08  [MKDSN1,5/2-5,08]

## Nets
+5V: C1.1 C2.1 C3.1 C4.2 C5.2 C6.2 C7.2 C8.2 IC1.16(VCC) IC2.16(VCC) IC3.16(VCC) IC4.16(VCC) IC5.16(VCC) IC6.16(VCC) IC7.16(VCC) JP5.2 R61.2 R66.2 R71.2 R76.2 R81.2 R86.2 R91.2 R109.2 R110.1 U1.8(VCC) X2.1
CLOCK: JP1.2 R58.2 R63.2 R68.2 R73.2 R78.2 R83.2 R88.2 R111.2
DATA: JP3.2 R87.2
GND: C1.2 C2.2 C3.2 C4.1 C5.1 C6.1 C7.1 C8.1 IC1.8(GND) IC2.8(GND) IC3.8(GND) IC4.8(GND) IC5.8(GND) IC6.8(GND) IC7.8(GND) JP4.3 JP5.6 R60.2 R65.2 R70.2 R75.2 R80.2 R85.2 R90.2 R92.2 R93.2 R94.2 R95.2 R96.2 R97.2 R98.2 R99.2 R100.2 R101.2 R102.2 R103.2 R104.2 R105.2 R106.2 R107.2 R108.2 T1.1(E) U1.4(GND) U$1.2(S) U$2.2(S) U$3.2(S) U$4.2(S) U$5.2(S) U$6.2(S) U$7.2(S) U$8.2(S) U$9.2(S) U$10.2(S) U$11.2(S) U$12.2(S) U$13.2(S) U$14.2(S) U$15.2(S) U$16.2(S) X2.2
LATCH: JP2.2 R59.2 R64.2 R69.2 R74.2 R79.2 R84.2 R89.2
MISO: JP1.3 JP5.1 U1.6(PB1)
MOSI: JP4.2 JP5.4 U1.5(PB0)
N$1: LED1.A LED2.A LED3.A LED4.A LED5.A LED6.A LED7.A LED8.A LED9.A LED10.A LED11.A LED12.A LED13.A LED14.A LED15.A LED16.A R3.1
N$2: LED2.K(C) LED18.K(C) LED34.K(C) LED50.K(C) LED66.K(C) LED82.K(C) LED98.K(C) LED114.K(C) LED130.K(C) LED146.K(C) LED162.K(C) LED178.K(C) LED194.K(C) LED210.K(C) LED226.K(C) LED242.K(C) LED258.K(C) LED274.K(C) LED290.K(C) LED306.K(C) LED322.K(C) LED338.K(C) LED354.K(C) LED370.K(C) LED386.K(C) LED402.K(C) LED418.K(C) LED434.K(C) LED450.K(C) LED466.K(C) LED482.K(C) LED498.K(C) LED514.K(C) LED530.K(C) LED546.K(C) LED562.K(C) LED578.K(C) LED594.K(C) LED610.K(C) LED626.K(C) U$2.3(D)
N$3: R4.2 R93.1 U$2.1(G)
N$4: LED3.K(C) LED19.K(C) LED35.K(C) LED51.K(C) LED67.K(C) LED83.K(C) LED99.K(C) LED115.K(C) LED131.K(C) LED147.K(C) LED163.K(C) LED179.K(C) LED195.K(C) LED211.K(C) LED227.K(C) LED243.K(C) LED259.K(C) LED275.K(C) LED291.K(C) LED307.K(C) LED323.K(C) LED339.K(C) LED355.K(C) LED371.K(C) LED387.K(C) LED403.K(C) LED419.K(C) LED435.K(C) LED451.K(C) LED467.K(C) LED483.K(C) LED499.K(C) LED515.K(C) LED531.K(C) LED547.K(C) LED563.K(C) LED579.K(C) LED595.K(C) LED611.K(C) LED627.K(C) U$3.3(D)
N$5: R5.2 R94.1 U$3.1(G)
N$6: LED4.K(C) LED20.K(C) LED36.K(C) LED52.K(C) LED68.K(C) LED84.K(C) LED100.K(C) LED116.K(C) LED132.K(C) LED148.K(C) LED164.K(C) LED180.K(C) LED196.K(C) LED212.K(C) LED228.K(C) LED244.K(C) LED260.K(C) LED276.K(C) LED292.K(C) LED308.K(C) LED324.K(C) LED340.K(C) LED356.K(C) LED372.K(C) LED388.K(C) LED404.K(C) LED420.K(C) LED436.K(C) LED452.K(C) LED468.K(C) LED484.K(C) LED500.K(C) LED516.K(C) LED532.K(C) LED548.K(C) LED564.K(C) LED580.K(C) LED596.K(C) LED612.K(C) LED628.K(C) U$4.3(D)
N$7: R6.2 R95.1 U$4.1(G)
N$8: LED5.K(C) LED21.K(C) LED37.K(C) LED53.K(C) LED69.K(C) LED85.K(C) LED101.K(C) LED117.K(C) LED133.K(C) LED149.K(C) LED165.K(C) LED181.K(C) LED197.K(C) LED213.K(C) LED229.K(C) LED245.K(C) LED261.K(C) LED277.K(C) LED293.K(C) LED309.K(C) LED325.K(C) LED341.K(C) LED357.K(C) LED373.K(C) LED389.K(C) LED405.K(C) LED421.K(C) LED437.K(C) LED453.K(C) LED469.K(C) LED485.K(C) LED501.K(C) LED517.K(C) LED533.K(C) LED549.K(C) LED565.K(C) LED581.K(C) LED597.K(C) LED613.K(C) LED629.K(C) U$5.3(D)
N$9: R7.2 R96.1 U$5.1(G)
N$10: LED6.K(C) LED22.K(C) LED38.K(C) LED54.K(C) LED70.K(C) LED86.K(C) LED102.K(C) LED118.K(C) LED134.K(C) LED150.K(C) LED166.K(C) LED182.K(C) LED198.K(C) LED214.K(C) LED230.K(C) LED246.K(C) LED262.K(C) LED278.K(C) LED294.K(C) LED310.K(C) LED326.K(C) LED342.K(C) LED358.K(C) LED374.K(C) LED390.K(C) LED406.K(C) LED422.K(C) LED438.K(C) LED454.K(C) LED470.K(C) LED486.K(C) LED502.K(C) LED518.K(C) LED534.K(C) LED550.K(C) LED566.K(C) LED582.K(C) LED598.K(C) LED614.K(C) LED630.K(C) U$6.3(D)
N$11: R8.2 R97.1 U$6.1(G)
N$12: LED7.K(C) LED23.K(C) LED39.K(C) LED55.K(C) LED71.K(C) LED87.K(C) LED103.K(C) LED119.K(C) LED135.K(C) LED151.K(C) LED167.K(C) LED183.K(C) LED199.K(C) LED215.K(C) LED231.K(C) LED247.K(C) LED263.K(C) LED279.K(C) LED295.K(C) LED311.K(C) LED327.K(C) LED343.K(C) LED359.K(C) LED375.K(C) LED391.K(C) LED407.K(C) LED423.K(C) LED439.K(C) LED455.K(C) LED471.K(C) LED487.K(C) LED503.K(C) LED519.K(C) LED535.K(C) LED551.K(C) LED567.K(C) LED583.K(C) LED599.K(C) LED615.K(C) LED631.K(C) U$7.3(D)
N$13: R9.2 R98.1 U$7.1(G)
N$14: LED8.K(C) LED24.K(C) LED40.K(C) LED56.K(C) LED72.K(C) LED88.K(C) LED104.K(C) LED120.K(C) LED136.K(C) LED152.K(C) LED168.K(C) LED184.K(C) LED200.K(C) LED216.K(C) LED232.K(C) LED248.K(C) LED264.K(C) LED280.K(C) LED296.K(C) LED312.K(C) LED328.K(C) LED344.K(C) LED360.K(C) LED376.K(C) LED392.K(C) LED408.K(C) LED424.K(C) LED440.K(C) LED456.K(C) LED472.K(C) LED488.K(C) LED504.K(C) LED520.K(C) LED536.K(C) LED552.K(C) LED568.K(C) LED584.K(C) LED600.K(C) LED616.K(C) LED632.K(C) U$8.3(D)
N$15: R10.2 R99.1 U$8.1(G)
N$16: LED1.K(C) LED17.K(C) LED33.K(C) LED49.K(C) LED65.K(C) LED81.K(C) LED97.K(C) LED113.K(C) LED129.K(C) LED145.K(C) LED161.K(C) LED177.K(C) LED193.K(C) LED209.K(C) LED225.K(C) LED241.K(C) LED257.K(C) LED273.K(C) LED289.K(C) LED305.K(C) LED321.K(C) LED337.K(C) LED353.K(C) LED369.K(C) LED385.K(C) LED401.K(C) LED417.K(C) LED433.K(C) LED449.K(C) LED465.K(C) LED481.K(C) LED497.K(C) LED513.K(C) LED529.K(C) LED545.K(C) LED561.K(C) LED577.K(C) LED593.K(C) LED609.K(C) LED625.K(C) U$1.3(D)
N$17: R1.2 R92.1 U$1.1(G)
N$18: LED9.K(C) LED25.K(C) LED41.K(C) LED57.K(C) LED73.K(C) LED89.K(C) LED105.K(C) LED121.K(C) LED137.K(C) LED153.K(C) LED169.K(C) LED185.K(C) LED201.K(C) LED217.K(C) LED233.K(C) LED249.K(C) LED265.K(C) LED281.K(C) LED297.K(C) LED313.K(C) LED329.K(C) LED345.K(C) LED361.K(C) LED377.K(C) LED393.K(C) LED409.K(C) LED425.K(C) LED441.K(C) LED457.K(C) LED473.K(C) LED489.K(C) LED505.K(C) LED521.K(C) LED537.K(C) LED553.K(C) LED569.K(C) LED585.K(C) LED601.K(C) LED617.K(C) LED633.K(C) U$9.3(D)
N$19: R11.2 R100.1 U$9.1(G)
N$20: LED10.K(C) LED26.K(C) LED42.K(C) LED58.K(C) LED74.K(C) LED90.K(C) LED106.K(C) LED122.K(C) LED138.K(C) LED154.K(C) LED170.K(C) LED186.K(C) LED202.K(C) LED218.K(C) LED234.K(C) LED250.K(C) LED266.K(C) LED282.K(C) LED298.K(C) LED314.K(C) LED330.K(C) LED346.K(C) LED362.K(C) LED378.K(C) LED394.K(C) LED410.K(C) LED426.K(C) LED442.K(C) LED458.K(C) LED474.K(C) LED490.K(C) LED506.K(C) LED522.K(C) LED538.K(C) LED554.K(C) LED570.K(C) LED586.K(C) LED602.K(C) LED618.K(C) LED634.K(C) U$10.3(D)
N$21: R12.2 R101.1 U$10.1(G)
N$22: LED11.K(C) LED27.K(C) LED43.K(C) LED59.K(C) LED75.K(C) LED91.K(C) LED107.K(C) LED123.K(C) LED139.K(C) LED155.K(C) LED171.K(C) LED187.K(C) LED203.K(C) LED219.K(C) LED235.K(C) LED251.K(C) LED267.K(C) LED283.K(C) LED299.K(C) LED315.K(C) LED331.K(C) LED347.K(C) LED363.K(C) LED379.K(C) LED395.K(C) LED411.K(C) LED427.K(C) LED443.K(C) LED459.K(C) LED475.K(C) LED491.K(C) LED507.K(C) LED523.K(C) LED539.K(C) LED555.K(C) LED571.K(C) LED587.K(C) LED603.K(C) LED619.K(C) LED635.K(C) U$11.3(D)
N$23: R13.2 R102.1 U$11.1(G)
N$24: LED12.K(C) LED28.K(C) LED44.K(C) LED60.K(C) LED76.K(C) LED92.K(C) LED108.K(C) LED124.K(C) LED140.K(C) LED156.K(C) LED172.K(C) LED188.K(C) LED204.K(C) LED220.K(C) LED236.K(C) LED252.K(C) LED268.K(C) LED284.K(C) LED300.K(C) LED316.K(C) LED332.K(C) LED348.K(C) LED364.K(C) LED380.K(C) LED396.K(C) LED412.K(C) LED428.K(C) LED444.K(C) LED460.K(C) LED476.K(C) LED492.K(C) LED508.K(C) LED524.K(C) LED540.K(C) LED556.K(C) LED572.K(C) LED588.K(C) LED604.K(C) LED620.K(C) LED636.K(C) U$12.3(D)
N$25: R14.2 R103.1 U$12.1(G)
N$26: LED13.K(C) LED29.K(C) LED45.K(C) LED61.K(C) LED77.K(C) LED93.K(C) LED109.K(C) LED125.K(C) LED141.K(C) LED157.K(C) LED173.K(C) LED189.K(C) LED205.K(C) LED221.K(C) LED237.K(C) LED253.K(C) LED269.K(C) LED285.K(C) LED301.K(C) LED317.K(C) LED333.K(C) LED349.K(C) LED365.K(C) LED381.K(C) LED397.K(C) LED413.K(C) LED429.K(C) LED445.K(C) LED461.K(C) LED477.K(C) LED493.K(C) LED509.K(C) LED525.K(C) LED541.K(C) LED557.K(C) LED573.K(C) LED589.K(C) LED605.K(C) LED621.K(C) LED637.K(C) U$13.3(D)
N$27: R15.2 R104.1 U$13.1(G)
N$28: LED14.K(C) LED30.K(C) LED46.K(C) LED62.K(C) LED78.K(C) LED94.K(C) LED110.K(C) LED126.K(C) LED142.K(C) LED158.K(C) LED174.K(C) LED190.K(C) LED206.K(C) LED222.K(C) LED238.K(C) LED254.K(C) LED270.K(C) LED286.K(C) LED302.K(C) LED318.K(C) LED334.K(C) LED350.K(C) LED366.K(C) LED382.K(C) LED398.K(C) LED414.K(C) LED430.K(C) LED446.K(C) LED462.K(C) LED478.K(C) LED494.K(C) LED510.K(C) LED526.K(C) LED542.K(C) LED558.K(C) LED574.K(C) LED590.K(C) LED606.K(C) LED622.K(C) LED638.K(C) U$14.3(D)
N$29: R16.2 R105.1 U$14.1(G)
N$30: LED15.K(C) LED31.K(C) LED47.K(C) LED63.K(C) LED79.K(C) LED95.K(C) LED111.K(C) LED127.K(C) LED143.K(C) LED159.K(C) LED175.K(C) LED191.K(C) LED207.K(C) LED223.K(C) LED239.K(C) LED255.K(C) LED271.K(C) LED287.K(C) LED303.K(C) LED319.K(C) LED335.K(C) LED351.K(C) LED367.K(C) LED383.K(C) LED399.K(C) LED415.K(C) LED431.K(C) LED447.K(C) LED463.K(C) LED479.K(C) LED495.K(C) LED511.K(C) LED527.K(C) LED543.K(C) LED559.K(C) LED575.K(C) LED591.K(C) LED607.K(C) LED623.K(C) LED639.K(C) U$15.3(D)
N$31: R17.2 R106.1 U$15.1(G)
N$32: LED16.K(C) LED32.K(C) LED48.K(C) LED64.K(C) LED80.K(C) LED96.K(C) LED112.K(C) LED128.K(C) LED144.K(C) LED160.K(C) LED176.K(C) LED192.K(C) LED208.K(C) LED224.K(C) LED240.K(C) LED256.K(C) LED272.K(C) LED288.K(C) LED304.K(C) LED320.K(C) LED336.K(C) LED352.K(C) LED368.K(C) LED384.K(C) LED400.K(C) LED416.K(C) LED432.K(C) LED448.K(C) LED464.K(C) LED480.K(C) LED496.K(C) LED512.K(C) LED528.K(C) LED544.K(C) LED560.K(C) LED576.K(C) LED592.K(C) LED608.K(C) LED624.K(C) LED640.K(C) U$16.3(D)
N$33: R18.2 R107.1 U$16.1(G)
N$34: LED17.A LED18.A LED19.A LED20.A LED21.A LED22.A LED23.A LED24.A LED25.A LED26.A LED27.A LED28.A LED29.A LED30.A LED31.A LED32.A R19.1
N$35: IC2.14(SER) R57.1
N$36: IC2.11(SCK) R58.1
N$37: IC2.12(RCK) R59.1
N$38: IC2.13(G) R60.1
N$39: IC2.10(SCL) R61.1
N$40: IC2.1(QB) R19.2
N$41: IC2.15(QA) R3.2
N$42: IC2.2(QC) R20.2
N$43: IC2.3(QD) R2.2
N$44: IC2.4(QE) R21.2
N$45: IC2.5(QF) R22.2
N$46: IC2.6(QG) R23.2
N$47: IC2.7(QH) R24.2
N$48: IC1.14(SER) R62.1
N$49: IC1.11(SCK) R63.1
N$50: IC1.12(RCK) R64.1
N$51: LED33.A LED34.A LED35.A LED36.A LED37.A LED38.A LED39.A LED40.A LED41.A LED42.A LED43.A LED44.A LED45.A LED46.A LED47.A LED48.A R20.1
N$52: LED49.A LED50.A LED51.A LED52.A LED53.A LED54.A LED55.A LED56.A LED57.A LED58.A LED59.A LED60.A LED61.A LED62.A LED63.A LED64.A R2.1
N$53: LED65.A LED66.A LED67.A LED68.A LED69.A LED70.A LED71.A LED72.A LED73.A LED74.A LED75.A LED76.A LED77.A LED78.A LED79.A LED80.A R21.1
N$54: LED81.A LED82.A LED83.A LED84.A LED85.A LED86.A LED87.A LED88.A LED89.A LED90.A LED91.A LED92.A LED93.A LED94.A LED95.A LED96.A R22.1
N$55: LED97.A LED98.A LED99.A LED100.A LED101.A LED102.A LED103.A LED104.A LED105.A LED106.A LED107.A LED108.A LED109.A LED110.A LED111.A LED112.A R23.1
N$56: LED113.A LED114.A LED115.A LED116.A LED117.A LED118.A LED119.A LED120.A LED121.A LED122.A LED123.A LED124.A LED125.A LED126.A LED127.A LED128.A R24.1
N$57: LED129.A LED130.A LED131.A LED132.A LED133.A LED134.A LED135.A LED136.A LED137.A LED138.A LED139.A LED140.A LED141.A LED142.A LED143.A LED144.A R25.1
N$58: LED145.A LED146.A LED147.A LED148.A LED149.A LED150.A LED151.A LED152.A LED153.A LED154.A LED155.A LED156.A LED157.A LED158.A LED159.A LED160.A R26.1
N$59: LED161.A LED162.A LED163.A LED164.A LED165.A LED166.A LED167.A LED168.A LED169.A LED170.A LED171.A LED172.A LED173.A LED174.A LED175.A LED176.A R27.1
N$60: LED177.A LED178.A LED179.A LED180.A LED181.A LED182.A LED183.A LED184.A LED185.A LED186.A LED187.A LED188.A LED189.A LED190.A LED191.A LED192.A R28.1
N$61: LED193.A LED194.A LED195.A LED196.A LED197.A LED198.A LED199.A LED200.A LED201.A LED202.A LED203.A LED204.A LED205.A LED206.A LED207.A LED208.A R29.1
N$62: LED209.A LED210.A LED211.A LED212.A LED213.A LED214.A LED215.A LED216.A LED217.A LED218.A LED219.A LED220.A LED221.A LED222.A LED223.A LED224.A R30.1
N$63: LED225.A LED226.A LED227.A LED228.A LED229.A LED230.A LED231.A LED232.A LED233.A LED234.A LED235.A LED236.A LED237.A LED238.A LED239.A LED240.A R31.1
N$64: LED241.A LED242.A LED243.A LED244.A LED245.A LED246.A LED247.A LED248.A LED249.A LED250.A LED251.A LED252.A LED253.A LED254.A LED255.A LED256.A R32.1
N$65: LED257.A LED258.A LED259.A LED260.A LED261.A LED262.A LED263.A LED264.A LED265.A LED266.A LED267.A LED268.A LED269.A LED270.A LED271.A LED272.A R33.1
N$66: LED273.A LED274.A LED275.A LED276.A LED277.A LED278.A LED279.A LED280.A LED281.A LED282.A LED283.A LED284.A LED285.A LED286.A LED287.A LED288.A R34.1
N$67: LED289.A LED290.A LED291.A LED292.A LED293.A LED294.A LED295.A LED296.A LED297.A LED298.A LED299.A LED300.A LED301.A LED302.A LED303.A LED304.A R35.1
N$68: LED305.A LED306.A LED307.A LED308.A LED309.A LED310.A LED311.A LED312.A LED313.A LED314.A LED315.A LED316.A LED317.A LED318.A LED319.A LED320.A R36.1
N$69: LED321.A LED322.A LED323.A LED324.A LED325.A LED326.A LED327.A LED328.A LED329.A LED330.A LED331.A LED332.A LED333.A LED334.A LED335.A LED336.A R37.1
N$70: LED337.A LED338.A LED339.A LED340.A LED341.A LED342.A LED343.A LED344.A LED345.A LED346.A LED347.A LED348.A LED349.A LED350.A LED351.A LED352.A R38.1
N$71: LED401.A LED402.A LED403.A LED404.A LED405.A LED406.A LED407.A LED408.A LED409.A LED410.A LED411.A LED412.A LED413.A LED414.A LED415.A LED416.A R42.1
N$72: LED481.A LED482.A LED483.A LED484.A LED485.A LED486.A LED487.A LED488.A LED489.A LED490.A LED491.A LED492.A LED493.A LED494.A LED495.A LED496.A R47.1
N$73: IC1.13(G) R65.1
N$74: IC1.10(SCL) R66.1
N$75: IC1.2(QC) R27.2
N$76: IC1.3(QD) R28.2
N$77: IC1.4(QE) R29.2
N$78: IC1.5(QF) R30.2
N$79: IC1.6(QG) R31.2
N$80: IC1.7(QH) R32.2
N$81: IC1.1(QB) R26.2
N$82: IC1.15(QA) R25.2
N$83: IC3.14(SER) R67.1
N$84: IC3.11(SCK) R68.1
N$85: IC3.12(RCK) R69.1
N$86: IC3.13(G) R70.1
N$87: LED353.A LED354.A LED355.A LED356.A LED357.A LED358.A LED359.A LED360.A LED361.A LED362.A LED363.A LED364.A LED365.A LED366.A LED367.A LED368.A R39.1
N$88: IC3.10(SCL) R71.1
N$89: LED417.A LED418.A LED419.A LED420.A LED421.A LED422.A LED423.A LED424.A LED425.A LED426.A LED427.A LED428.A LED429.A LED430.A LED431.A LED432.A R43.1
N$90: IC3.2(QC) R35.2
N$91: LED497.A LED498.A LED499.A LED500.A LED501.A LED502.A LED503.A LED504.A LED505.A LED506.A LED507.A LED508.A LED509.A LED510.A LED511.A LED512.A R48.1
N$92: IC3.3(QD) R36.2
N$93: IC3.4(QE) R37.2
N$94: IC3.5(QF) R38.2
N$95: IC3.6(QG) R39.2
N$96: IC3.7(QH) R40.2
N$97: IC3.1(QB) R34.2
N$98: IC3.15(QA) R33.2
N$99: IC4.14(SER) R72.1
N$100: IC4.11(SCK) R73.1
N$101: IC4.12(RCK) R74.1
N$102: IC4.13(G) R75.1
N$103: IC4.10(SCL) R76.1
N$104: LED369.A LED370.A LED371.A LED372.A LED373.A LED374.A LED375.A LED376.A LED377.A LED378.A LED379.A LED380.A LED381.A LED382.A LED383.A LED384.A R40.1
N$105: IC4.2(QC) R43.2
N$106: IC4.3(QD) R44.2
N$107: LED433.A LED434.A LED435.A LED436.A LED437.A LED438.A LED439.A LED440.A LED441.A LED442.A LED443.A LED444.A LED445.A LED446.A LED447.A LED448.A R44.1
N$108: IC4.4(QE) R45.2
N$109: IC4.5(QF) R46.2
N$110: LED513.A LED514.A LED515.A LED516.A LED517.A LED518.A LED519.A LED520.A LED521.A LED522.A LED523.A LED524.A LED525.A LED526.A LED527.A LED528.A R49.1
N$111: IC4.6(QG) R47.2
N$112: IC4.7(QH) R48.2
N$113: IC4.1(QB) R42.2
N$114: IC4.15(QA) R41.2
N$115: IC5.14(SER) R77.1
N$116: IC5.11(SCK) R78.1
N$117: IC5.12(RCK) R79.1
N$118: IC5.13(G) R80.1
N$119: IC5.10(SCL) R81.1
N$120: IC5.2(QC) R51.2
N$121: LED385.A LED386.A LED387.A LED388.A LED389.A LED390.A LED391.A LED392.A LED393.A LED394.A LED395.A LED396.A LED397.A LED398.A LED399.A LED400.A R41.1
N$122: IC5.3(QD) R52.2
N$123: IC5.4(QE) R53.2
N$124: IC5.5(QF) R54.2
N$125: LED449.A LED450.A LED451.A LED452.A LED453.A LED454.A LED455.A LED456.A LED457.A LED458.A LED459.A LED460.A LED461.A LED462.A LED463.A LED464.A R45.1
N$126: IC5.6(QG) R55.2
N$127: IC5.7(QH) R56.2
N$128: IC5.1(QB) R50.2
N$129: LED529.A LED530.A LED531.A LED532.A LED533.A LED534.A LED535.A LED536.A LED537.A LED538.A LED539.A LED540.A LED541.A LED542.A LED543.A LED544.A R50.1
N$130: IC5.15(QA) R49.2
N$131: IC6.14(SER) R82.1
N$132: IC6.11(SCK) R83.1
N$133: IC6.12(RCK) R84.1
N$134: IC6.13(G) R85.1
N$135: IC6.10(SCL) R86.1
N$136: IC6.2(QC) R8.1
N$137: IC6.3(QD) R7.1
N$138: IC6.4(QE) R6.1
N$139: IC6.5(QF) R5.1
N$140: IC6.6(QG) R4.1
N$141: IC6.7(QH) R1.1
N$142: LED465.A LED466.A LED467.A LED468.A LED469.A LED470.A LED471.A LED472.A LED473.A LED474.A LED475.A LED476.A LED477.A LED478.A LED479.A LED480.A R46.1
N$143: IC6.1(QB) R9.1
N$144: IC6.15(QA) R10.1
N$145: IC7.14(SER) R87.1
N$146: IC7.11(SCK) R88.1
N$147: LED545.A LED546.A LED547.A LED548.A LED549.A LED550.A LED551.A LED552.A LED553.A LED554.A LED555.A LED556.A LED557.A LED558.A LED559.A LED560.A R51.1
N$148: IC7.12(RCK) R89.1
N$149: IC7.13(G) R90.1
N$150: IC7.10(SCL) R91.1
N$151: IC7.2(QC) R16.1
N$152: IC7.3(QD) R15.1
N$153: IC7.4(QE) R14.1
N$154: IC7.5(QF) R13.1
N$155: IC7.6(QG) R12.1
N$156: IC7.7(QH) R11.1
N$157: IC7.1(QB) R17.1
N$158: IC7.15(QA) R18.1
N$159: IC1.9(QH*) R67.2
N$160: IC3.9(QH*) R72.2
N$161: IC4.9(QH*) R77.2
N$162: IC2.9(QH*) R62.2
N$163: IC7.9(QH*) R82.2
N$164: LED561.A LED562.A LED563.A LED564.A LED565.A LED566.A LED567.A LED568.A LED569.A LED570.A LED571.A LED572.A LED573.A LED574.A LED575.A LED576.A R52.1
N$165: IC6.9(QH*) R57.2
N$166: JP6.1 R110.2 T1.3(C)
N$167: C9.2 R108.1 S1.3(P) S1.4(P1)
N$168: JP3.1 X1.3
N$169: JP1.1 X1.2
N$170: JP2.1 X1.1
N$171: R111.1 T1.2(B)
N$172: JP2.3 U1.3(PB4)
N$173: JP3.3 U1.2(PB3)
N$181: LED577.A LED578.A LED579.A LED580.A LED581.A LED582.A LED583.A LED584.A LED585.A LED586.A LED587.A LED588.A LED589.A LED590.A LED591.A LED592.A R53.1
N$198: LED593.A LED594.A LED595.A LED596.A LED597.A LED598.A LED599.A LED600.A LED601.A LED602.A LED603.A LED604.A LED605.A LED606.A LED607.A LED608.A R54.1
N$215: LED609.A LED610.A LED611.A LED612.A LED613.A LED614.A LED615.A LED616.A LED617.A LED618.A LED619.A LED620.A LED621.A LED622.A LED623.A LED624.A R55.1
N$232: LED625.A LED626.A LED627.A LED628.A LED629.A LED630.A LED631.A LED632.A LED633.A LED634.A LED635.A LED636.A LED637.A LED638.A LED639.A LED640.A R56.1
RESET: C9.1 JP5.5 R109.1 S1.1(S) S1.2(S1) U1.1(PB5)
SCK: JP4.1 JP5.3 U1.7(PB2)
Unconnected: IC5.9(QH*)

## Notes on the sheet
- ISP-6 Breakout
- Power Input
- Inverted Clock signal
- I2C Breakout
- External signal input

## Library data of the parts
C1-C9 = rcl:C-EU: CAPACITOR, European symbol; SPICEPREFIX: C
IC1-IC7 = 74xx-eu:74*595: 8-bit SHIFT REGISTER, output latch
JP1-JP4 = pinhead:PINHD-1X3: PIN HEADER
JP5 = pinhead:PINHD-2X3: PIN HEADER
JP6 = pinhead:PINHD-1X1: PIN HEADER
LED1-LED640 = led:LED: LED OSRAM: - CHIPLED LG R971, LG N971, LY N971, LG Q971, LY Q971, LO R971, LY R971 LH N974, LH R974 LS Q976, LO Q976, LY Q976 LO Q996 - Hyper CHIPLED LW Q18S LB Q993, LB Q99A, LB R99A - SideLED LS A670, LO A670, LY A670, LG A670, LP A670 LB A673, LV A673, LT A673, LW A673 LH A674 LY A675 LS A676, LA A676, LO A676, LY A676, LW A676 LS A679, LY A679, LG A679 - Hyper Micro SIDELED® LS Y876, LA Y876, LO Y876, LY Y876 LT Y87S - SmartLED LW L88C, LW L88S LB L89C, LB L89S, LG L890 LS L89K, LO L89K, LY L89K LS L896, LA L896, LO L896, LY L896 - TOPLED LS T670, LO T670, LY T670, LG T670, LP T670 LSG T670, LSP T670, LSY T670, LOP T670, LYG T670 LG T671, LOG T671, LSG T671 LB T673, LV T673, LT T673, LW T673 LH T674 LS T676, LA T676, LO T676, LY T676, LB T676, LH T676, LSB T676, LW T676 LB T67C, LV T67C, LT T67C, LS T67K, LO T67K, LY T67K, LW E67C LS E67B, LA E67B, LO E67B, LY E67B, LB E67C, LV E67C, LT E67C LW T67C LS T679, LY T679, LG T679 LS T770, LO T770, LY T770, LG T770, LP T770 LB T773, LV T773, LT T773, LW T773 LH T774 LS E675, LA E675, LY E675, LS T675 LS T776, LA T776, LO T776, LY T776, LB T776 LHGB T686 LT T68C, LB T68C - Hyper Mini TOPLED® LB M676 - Mini TOPLED Santana® LG M470 LS M47K, LO M47K, LY M47K Source: http://www.osram.convergy.de LUXEON: - LUMILED® LXK2-PW12-R00, LXK2-PW12-S00, LXK2-PW14-U00, LXK2-PW14-V00 LXK2-PM12-R00, LXK2-PM12-S00, LXK2-PM14-U00 LXK2-PE12-Q00, LXK2-PE12-R00, LXK2-PE12-S00, LXK2-PE14-T00, LXK2-PE14-U00 LXK2-PB12-K00, LXK2-PB12-L00, LXK2-PB12-M00, LXK2-PB14-N00, LXK2-PB14-P00, LXK2-PB14-Q00 LXK2-PR12-L00, LXK2-PR12-M00, LXK2-PR14-Q00, LXK2-PR14-R00 LXK2-PD12-Q00, LXK2-PD12-R00, LXK2-PD12-S00 LXK2-PH12-R00, LXK2-PH12-S00 LXK2-PL12-P00, LXK2-PL12-Q00, LXK2-PL12-R00 Source: www.luxeon.com KINGBRIGHT: KA-3528ASYC Source: www.kingbright.com
R1-R111 = rcl:R-EU_: RESISTOR, European symbol; SPICEPREFIX: R
S1 = switch-omron:10-XX: OMRON SWITCH; MPN: B3F-1000; OC_FARNELL: 176432; OC_NEWARK: 36M3542
T1 = transistor:BC547: NPN TRANSISTOR
U1 = Microcontroller:ATTINY85-20SU: IC MCU 8BIT 8KB FLASH 8SOIC Manufacturer's datasheet <http://ww1.microchip.com/downloads/en/DeviceDoc/Atmel-2586-AVR-8-bit-Microcontroller-ATtiny25-ATtiny45-ATtiny85_Datasheet-Summary.pdf>; CREATED_BY: PCBLayout.com; DIGI_KEY_PART_NUMBER: ATTINY85-20SU-ND; MANUFACTURER: Microchip Technology; MPN: ATTINY85-20SU; PACKAGE: 8-SOIC
U$1-U$16 = IRLML2030:IRLML2030: N-Chanel Mosfet UDS 30 V Id 2,7 A Ptot 1,3 W RDS(on) 0,1 Ohm fT 30 MHz td (on) 4,1 ns td (off) 4,5 ns
X1 = con-phoenix-508:MKDSN1,5/3-5,08: MKDSN 1,5/ 3-5,08 Printklemme Nennstrom: 13,5 A Nennspannung: 250 V Rastermaß: 5,08 mm Polzahl: 3 Anschlussart: Schraubanschluss Montage: Löten Anschlussrichtung Leiter/Platine: 0 ° Artikelnummer: 1729131 Source: http://eshop.phoenixcontact.com .. 1729131.pdf
X2 = con-phoenix-508:MKDSN1,5/2-5,08: MKDSN 1,5/ 2-5,08 Printklemme Nennstrom: 13,5 A Nennspannung: 250 V Rastermaß: 5,08 mm Polzahl: 2 Anschlussart: Schraubanschluss Montage: Löten Anschlussrichtung Leiter/Platine: 0 ° Artikelnummer: 1729128 Source: http://eshop.phoenixcontact.com .. 1729128.pdf